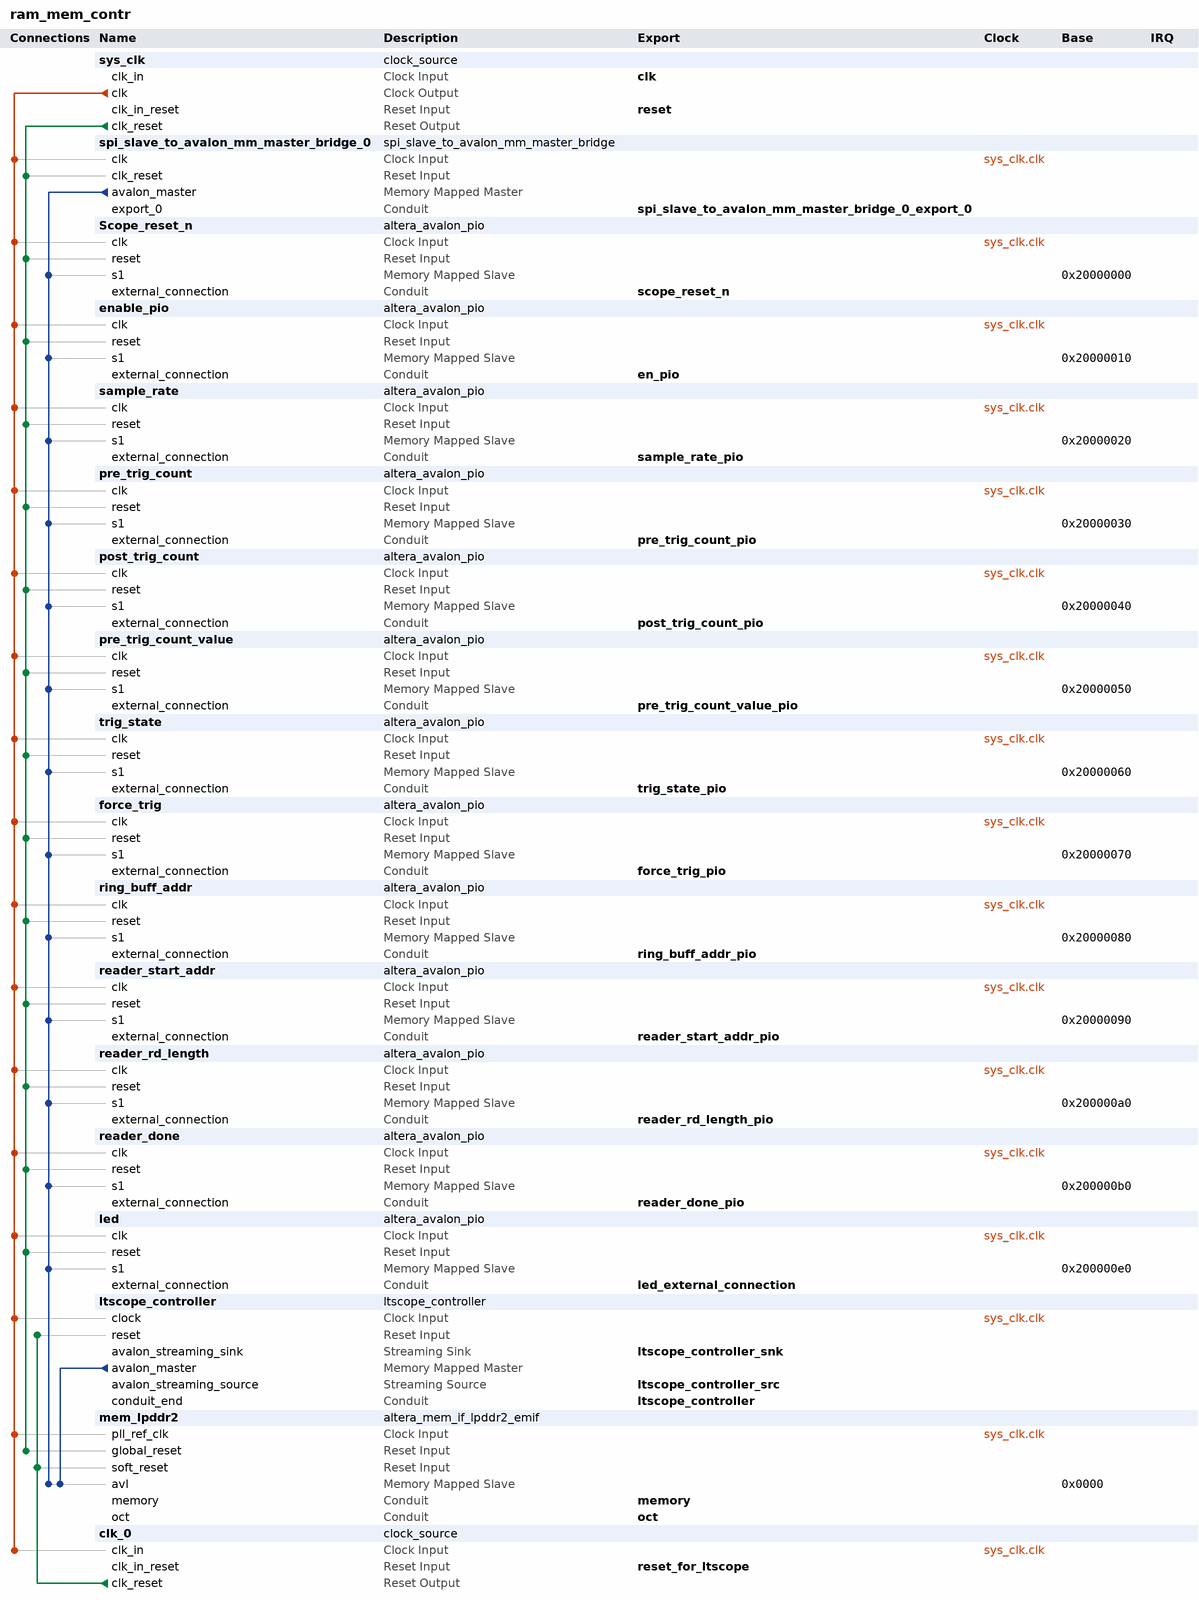
[diagram p0: system contents]
# Platform Designer (Qsys) system ram_mem_contr, Cyclone V 5CGXFC5C6F27C7
# Parameters at their usual value, and those the tool derives, are not listed.
package require -exact qsys 14.1
create_system ram_mem_contr
set_project_property DEVICE_FAMILY {Cyclone V}
set_project_property DEVICE 5CGXFC5C6F27C7

add_instance sys_clk clock_source 14.1
set_instance_parameter_value sys_clk clockFrequency 125000000

add_instance spi_slave_to_avalon_mm_master_bridge_0 spi_slave_to_avalon_mm_master_bridge 14.1
set_instance_parameter_value spi_slave_to_avalon_mm_master_bridge_0 SYNC_DEPTH 2

add_instance Scope_reset_n altera_avalon_pio 14.1
set_instance_parameter_value Scope_reset_n direction Output
set_instance_parameter_value Scope_reset_n width 1

add_instance enable_pio altera_avalon_pio 14.1
set_instance_parameter_value enable_pio direction Output
set_instance_parameter_value enable_pio width 4

add_instance sample_rate altera_avalon_pio 14.1
set_instance_parameter_value sample_rate captureEdge true
set_instance_parameter_value sample_rate direction Output
set_instance_parameter_value sample_rate width 16

add_instance pre_trig_count altera_avalon_pio 14.1
set_instance_parameter_value pre_trig_count direction Output
set_instance_parameter_value pre_trig_count width 32

add_instance post_trig_count altera_avalon_pio 14.1
set_instance_parameter_value post_trig_count direction Output
set_instance_parameter_value post_trig_count width 32

add_instance pre_trig_count_value altera_avalon_pio 14.1
set_instance_parameter_value pre_trig_count_value direction Input
set_instance_parameter_value pre_trig_count_value resetValue 1
set_instance_parameter_value pre_trig_count_value width 32

add_instance trig_state altera_avalon_pio 14.1
set_instance_parameter_value trig_state direction Input
set_instance_parameter_value trig_state width 1

add_instance force_trig altera_avalon_pio 14.1
set_instance_parameter_value force_trig direction Output
set_instance_parameter_value force_trig width 1

add_instance ring_buff_addr altera_avalon_pio 14.1
set_instance_parameter_value ring_buff_addr direction Input
set_instance_parameter_value ring_buff_addr width 32

add_instance reader_start_addr altera_avalon_pio 14.1
set_instance_parameter_value reader_start_addr direction Output
set_instance_parameter_value reader_start_addr width 32

add_instance reader_rd_length altera_avalon_pio 14.1
set_instance_parameter_value reader_rd_length direction Output
set_instance_parameter_value reader_rd_length width 32

add_instance reader_done altera_avalon_pio 14.1
set_instance_parameter_value reader_done direction Input
set_instance_parameter_value reader_done width 1

add_instance led altera_avalon_pio 14.1
set_instance_parameter_value led direction Output
set_instance_parameter_value led width 8

add_instance ltscope_controller ltscope_controller 2.0
set_instance_parameter_value ltscope_controller ADDRESS_DEPTH 29

add_instance mem_lpddr2 altera_mem_if_lpddr2_emif 14.1
set_instance_parameter_value mem_lpddr2 ABSTRACT_REAL_COMPARE_TEST false
set_instance_parameter_value mem_lpddr2 ABS_RAM_MEM_INIT_FILENAME meminit
set_instance_parameter_value mem_lpddr2 ACV_PHY_CLK_ADD_FR_PHASE 0.0
set_instance_parameter_value mem_lpddr2 AC_PACKAGE_DESKEW false
set_instance_parameter_value mem_lpddr2 AC_ROM_USER_ADD_0 0_0000_0000_0000
set_instance_parameter_value mem_lpddr2 AC_ROM_USER_ADD_1 0_0000_0000_1000
set_instance_parameter_value mem_lpddr2 ADDR_ORDER 0
set_instance_parameter_value mem_lpddr2 ADD_EFFICIENCY_MONITOR false
set_instance_parameter_value mem_lpddr2 ADD_EXTERNAL_SEQ_DEBUG_NIOS false
set_instance_parameter_value mem_lpddr2 ADVANCED_CK_PHASES false
set_instance_parameter_value mem_lpddr2 ADVERTIZE_SEQUENCER_SW_BUILD_FILES false
set_instance_parameter_value mem_lpddr2 AFI_DEBUG_INFO_WIDTH 32
set_instance_parameter_value mem_lpddr2 ALTMEMPHY_COMPATIBLE_MODE false
set_instance_parameter_value mem_lpddr2 AP_MODE false
set_instance_parameter_value mem_lpddr2 AP_MODE_EN 0
set_instance_parameter_value mem_lpddr2 AVL_DATA_WIDTH_PORT 32,32,32,32,32,32
set_instance_parameter_value mem_lpddr2 AVL_MAX_SIZE 4
set_instance_parameter_value mem_lpddr2 BYTE_ENABLE true
set_instance_parameter_value mem_lpddr2 C2P_WRITE_CLOCK_ADD_PHASE 0.0
set_instance_parameter_value mem_lpddr2 CALIBRATION_MODE Skip
set_instance_parameter_value mem_lpddr2 CALIB_REG_WIDTH 8
set_instance_parameter_value mem_lpddr2 CFG_DATA_REORDERING_TYPE INTER_BANK
set_instance_parameter_value mem_lpddr2 CFG_REORDER_DATA true
set_instance_parameter_value mem_lpddr2 CFG_TCCD_NS 2.5
set_instance_parameter_value mem_lpddr2 COMMAND_PHASE 0.0
set_instance_parameter_value mem_lpddr2 CONTROLLER_LATENCY 5
set_instance_parameter_value mem_lpddr2 CORE_DEBUG_CONNECTION EXPORT
set_instance_parameter_value mem_lpddr2 CPORT_TYPE_PORT Bidirectional,Bidirectional,Bidirectional,Bidirectional,Bidirectional,Bidirectional
set_instance_parameter_value mem_lpddr2 CTL_AUTOPCH_EN false
set_instance_parameter_value mem_lpddr2 CTL_CMD_QUEUE_DEPTH 8
set_instance_parameter_value mem_lpddr2 CTL_CSR_CONNECTION INTERNAL_JTAG
set_instance_parameter_value mem_lpddr2 CTL_CSR_ENABLED false
set_instance_parameter_value mem_lpddr2 CTL_CSR_READ_ONLY 1
set_instance_parameter_value mem_lpddr2 CTL_DEEP_POWERDN_EN false
set_instance_parameter_value mem_lpddr2 CTL_DYNAMIC_BANK_ALLOCATION false
set_instance_parameter_value mem_lpddr2 CTL_DYNAMIC_BANK_NUM 4
set_instance_parameter_value mem_lpddr2 CTL_ECC_AUTO_CORRECTION_ENABLED false
set_instance_parameter_value mem_lpddr2 CTL_ECC_ENABLED false
set_instance_parameter_value mem_lpddr2 CTL_ENABLE_BURST_INTERRUPT false
set_instance_parameter_value mem_lpddr2 CTL_ENABLE_BURST_TERMINATE false
set_instance_parameter_value mem_lpddr2 CTL_HRB_ENABLED false
set_instance_parameter_value mem_lpddr2 CTL_LOOK_AHEAD_DEPTH 4
set_instance_parameter_value mem_lpddr2 CTL_SELF_REFRESH_EN false
set_instance_parameter_value mem_lpddr2 CTL_USR_REFRESH_EN false
set_instance_parameter_value mem_lpddr2 CTL_ZQCAL_EN false
set_instance_parameter_value mem_lpddr2 CUT_NEW_FAMILY_TIMING true
set_instance_parameter_value mem_lpddr2 DAT_DATA_WIDTH 32
set_instance_parameter_value mem_lpddr2 DEBUG_MODE false
set_instance_parameter_value mem_lpddr2 DEVICE_DEPTH 1
set_instance_parameter_value mem_lpddr2 DISABLE_CHILD_MESSAGING false
set_instance_parameter_value mem_lpddr2 DISCRETE_FLY_BY true
set_instance_parameter_value mem_lpddr2 DLL_SHARING_MODE None
set_instance_parameter_value mem_lpddr2 DQS_DQSN_MODE DIFFERENTIAL
set_instance_parameter_value mem_lpddr2 DQ_INPUT_REG_USE_CLKN false
set_instance_parameter_value mem_lpddr2 DUPLICATE_AC false
set_instance_parameter_value mem_lpddr2 ED_EXPORT_SEQ_DEBUG false
set_instance_parameter_value mem_lpddr2 ENABLE_ABS_RAM_MEM_INIT false
set_instance_parameter_value mem_lpddr2 ENABLE_BONDING false
set_instance_parameter_value mem_lpddr2 ENABLE_BURST_MERGE false
set_instance_parameter_value mem_lpddr2 ENABLE_CTRL_AVALON_INTERFACE true
set_instance_parameter_value mem_lpddr2 ENABLE_DELAY_CHAIN_WRITE false
set_instance_parameter_value mem_lpddr2 ENABLE_EMIT_BFM_MASTER false
set_instance_parameter_value mem_lpddr2 ENABLE_EXPORT_SEQ_DEBUG_BRIDGE false
set_instance_parameter_value mem_lpddr2 ENABLE_EXTRA_REPORTING false
set_instance_parameter_value mem_lpddr2 ENABLE_ISS_PROBES false
set_instance_parameter_value mem_lpddr2 ENABLE_NON_DESTRUCTIVE_CALIB false
set_instance_parameter_value mem_lpddr2 ENABLE_NON_DES_CAL false
set_instance_parameter_value mem_lpddr2 ENABLE_NON_DES_CAL_TEST false
set_instance_parameter_value mem_lpddr2 ENABLE_SEQUENCER_MARGINING_ON_BY_DEFAULT false
set_instance_parameter_value mem_lpddr2 ENABLE_USER_ECC false
set_instance_parameter_value mem_lpddr2 EXPORT_AFI_HALF_CLK false
set_instance_parameter_value mem_lpddr2 FORCED_NON_LDC_ADDR_CMD_MEM_CK_INVERT false
set_instance_parameter_value mem_lpddr2 FORCED_NUM_WRITE_FR_CYCLE_SHIFTS 0
set_instance_parameter_value mem_lpddr2 FORCE_DQS_TRACKING AUTO
set_instance_parameter_value mem_lpddr2 FORCE_MAX_LATENCY_COUNT_WIDTH 0
set_instance_parameter_value mem_lpddr2 FORCE_SEQUENCER_TCL_DEBUG_MODE false
set_instance_parameter_value mem_lpddr2 FORCE_SHADOW_REGS AUTO
set_instance_parameter_value mem_lpddr2 HARD_EMIF false
set_instance_parameter_value mem_lpddr2 HCX_COMPAT_MODE false
set_instance_parameter_value mem_lpddr2 HHP_HPS false
set_instance_parameter_value mem_lpddr2 HHP_HPS_SIMULATION false
set_instance_parameter_value mem_lpddr2 HHP_HPS_VERIFICATION false
set_instance_parameter_value mem_lpddr2 HPS_PROTOCOL DEFAULT
set_instance_parameter_value mem_lpddr2 INCLUDE_BOARD_DELAY_MODEL false
set_instance_parameter_value mem_lpddr2 INCLUDE_MULTIRANK_BOARD_DELAY_MODEL false
set_instance_parameter_value mem_lpddr2 IS_ES_DEVICE false
set_instance_parameter_value mem_lpddr2 LOCAL_ID_WIDTH 8
set_instance_parameter_value mem_lpddr2 MARGIN_VARIATION_TEST false
set_instance_parameter_value mem_lpddr2 MAX_PENDING_RD_CMD 32
set_instance_parameter_value mem_lpddr2 MAX_PENDING_WR_CMD 16
set_instance_parameter_value mem_lpddr2 MEM_ATCL 0
set_instance_parameter_value mem_lpddr2 MEM_AUTO_LEVELING_MODE true
set_instance_parameter_value mem_lpddr2 MEM_BANKADDR_WIDTH 3
set_instance_parameter_value mem_lpddr2 MEM_BL 8
set_instance_parameter_value mem_lpddr2 MEM_BT Sequential
set_instance_parameter_value mem_lpddr2 MEM_CK_PHASE 0.0
set_instance_parameter_value mem_lpddr2 MEM_CK_WIDTH 1
set_instance_parameter_value mem_lpddr2 MEM_CLK_EN_WIDTH 1
set_instance_parameter_value mem_lpddr2 MEM_CLK_FREQ 300.0
set_instance_parameter_value mem_lpddr2 MEM_CLK_FREQ_MAX 400.0
set_instance_parameter_value mem_lpddr2 MEM_COL_ADDR_WIDTH 10
set_instance_parameter_value mem_lpddr2 MEM_CS_WIDTH 1
set_instance_parameter_value mem_lpddr2 MEM_DEVICE MISSING_MODEL
set_instance_parameter_value mem_lpddr2 MEM_DLL_EN true
set_instance_parameter_value mem_lpddr2 MEM_DQ_PER_DQS 8
set_instance_parameter_value mem_lpddr2 MEM_DQ_WIDTH 32
set_instance_parameter_value mem_lpddr2 MEM_DRV_STR 40
set_instance_parameter_value mem_lpddr2 MEM_FORMAT DISCRETE
set_instance_parameter_value mem_lpddr2 MEM_GUARANTEED_WRITE_INIT false
set_instance_parameter_value mem_lpddr2 MEM_IF_BOARD_BASE_DELAY 10
set_instance_parameter_value mem_lpddr2 MEM_IF_DM_PINS_EN true
set_instance_parameter_value mem_lpddr2 MEM_IF_DQSN_EN true
set_instance_parameter_value mem_lpddr2 MEM_IF_SIM_VALID_WINDOW 0
set_instance_parameter_value mem_lpddr2 MEM_INIT_EN false
set_instance_parameter_value mem_lpddr2 MEM_MIRROR_ADDRESSING 0
set_instance_parameter_value mem_lpddr2 MEM_NUMBER_OF_DIMMS 1
set_instance_parameter_value mem_lpddr2 MEM_NUMBER_OF_RANKS_PER_DEVICE 1
set_instance_parameter_value mem_lpddr2 MEM_NUMBER_OF_RANKS_PER_DIMM 1
set_instance_parameter_value mem_lpddr2 MEM_RANK_MULTIPLICATION_FACTOR 1
set_instance_parameter_value mem_lpddr2 MEM_ROW_ADDR_WIDTH 14
set_instance_parameter_value mem_lpddr2 MEM_TCL 7
set_instance_parameter_value mem_lpddr2 MEM_TFAW_NS 50.0
set_instance_parameter_value mem_lpddr2 MEM_TINIT_US 200
set_instance_parameter_value mem_lpddr2 MEM_TMRD_CK 2
set_instance_parameter_value mem_lpddr2 MEM_TRAS_NS 70.0
set_instance_parameter_value mem_lpddr2 MEM_TRCD_NS 18.0
set_instance_parameter_value mem_lpddr2 MEM_TREFI_US 3.9
set_instance_parameter_value mem_lpddr2 MEM_TRFC_NS 60.0
set_instance_parameter_value mem_lpddr2 MEM_TRP_NS 18.0
set_instance_parameter_value mem_lpddr2 MEM_TRRD_NS 10.0
set_instance_parameter_value mem_lpddr2 MEM_TRTP_NS 7.5
set_instance_parameter_value mem_lpddr2 MEM_TWR_NS 15.0
set_instance_parameter_value mem_lpddr2 MEM_TWTR 2
set_instance_parameter_value mem_lpddr2 MEM_USER_LEVELING_MODE Leveling
set_instance_parameter_value mem_lpddr2 MEM_VENDOR JEDEC
set_instance_parameter_value mem_lpddr2 MEM_VERBOSE true
set_instance_parameter_value mem_lpddr2 MRS_MIRROR_PING_PONG_ATSO false
set_instance_parameter_value mem_lpddr2 MULTICAST_EN false
set_instance_parameter_value mem_lpddr2 NEXTGEN true
set_instance_parameter_value mem_lpddr2 NIOS_ROM_DATA_WIDTH 32
set_instance_parameter_value mem_lpddr2 NUM_DLL_SHARING_INTERFACES 1
set_instance_parameter_value mem_lpddr2 NUM_EXTRA_REPORT_PATH 10
set_instance_parameter_value mem_lpddr2 NUM_OCT_SHARING_INTERFACES 1
set_instance_parameter_value mem_lpddr2 NUM_OF_PORTS 1
set_instance_parameter_value mem_lpddr2 NUM_PLL_SHARING_INTERFACES 1
set_instance_parameter_value mem_lpddr2 OCT_SHARING_MODE None
set_instance_parameter_value mem_lpddr2 P2C_READ_CLOCK_ADD_PHASE 0.0
set_instance_parameter_value mem_lpddr2 PACKAGE_DESKEW false
set_instance_parameter_value mem_lpddr2 PARSE_FRIENDLY_DEVICE_FAMILY_PARAM_VALID false
set_instance_parameter_value mem_lpddr2 PHY_CSR_CONNECTION INTERNAL_JTAG
set_instance_parameter_value mem_lpddr2 PHY_CSR_ENABLED false
set_instance_parameter_value mem_lpddr2 PHY_ONLY false
set_instance_parameter_value mem_lpddr2 PINGPONGPHY_EN false
set_instance_parameter_value mem_lpddr2 PLL_ADDR_CMD_CLK_DIV_PARAM 0
set_instance_parameter_value mem_lpddr2 PLL_ADDR_CMD_CLK_FREQ_PARAM 0.0
set_instance_parameter_value mem_lpddr2 PLL_ADDR_CMD_CLK_MULT_PARAM 0
set_instance_parameter_value mem_lpddr2 PLL_ADDR_CMD_CLK_PHASE_PS_PARAM 0
set_instance_parameter_value mem_lpddr2 PLL_AFI_CLK_DIV_PARAM 0
set_instance_parameter_value mem_lpddr2 PLL_AFI_CLK_FREQ_PARAM 0.0
set_instance_parameter_value mem_lpddr2 PLL_AFI_CLK_MULT_PARAM 0
set_instance_parameter_value mem_lpddr2 PLL_AFI_CLK_PHASE_PS_PARAM 0
set_instance_parameter_value mem_lpddr2 PLL_AFI_HALF_CLK_DIV_PARAM 0
set_instance_parameter_value mem_lpddr2 PLL_AFI_HALF_CLK_FREQ_PARAM 0.0
set_instance_parameter_value mem_lpddr2 PLL_AFI_HALF_CLK_MULT_PARAM 0
set_instance_parameter_value mem_lpddr2 PLL_AFI_HALF_CLK_PHASE_PS_PARAM 0
set_instance_parameter_value mem_lpddr2 PLL_AFI_PHY_CLK_DIV_PARAM 0
set_instance_parameter_value mem_lpddr2 PLL_AFI_PHY_CLK_FREQ_PARAM 0.0
set_instance_parameter_value mem_lpddr2 PLL_AFI_PHY_CLK_MULT_PARAM 0
set_instance_parameter_value mem_lpddr2 PLL_AFI_PHY_CLK_PHASE_PS_PARAM 0
set_instance_parameter_value mem_lpddr2 PLL_C2P_WRITE_CLK_DIV_PARAM 0
set_instance_parameter_value mem_lpddr2 PLL_C2P_WRITE_CLK_FREQ_PARAM 0.0
set_instance_parameter_value mem_lpddr2 PLL_C2P_WRITE_CLK_MULT_PARAM 0
set_instance_parameter_value mem_lpddr2 PLL_C2P_WRITE_CLK_PHASE_PS_PARAM 0
set_instance_parameter_value mem_lpddr2 PLL_CLK_PARAM_VALID false
set_instance_parameter_value mem_lpddr2 PLL_CONFIG_CLK_DIV_PARAM 0
set_instance_parameter_value mem_lpddr2 PLL_CONFIG_CLK_FREQ_PARAM 0.0
set_instance_parameter_value mem_lpddr2 PLL_CONFIG_CLK_MULT_PARAM 0
set_instance_parameter_value mem_lpddr2 PLL_CONFIG_CLK_PHASE_PS_PARAM 0
set_instance_parameter_value mem_lpddr2 PLL_DR_CLK_DIV_PARAM 0
set_instance_parameter_value mem_lpddr2 PLL_DR_CLK_FREQ_PARAM 0.0
set_instance_parameter_value mem_lpddr2 PLL_DR_CLK_MULT_PARAM 0
set_instance_parameter_value mem_lpddr2 PLL_DR_CLK_PHASE_PS_PARAM 0
set_instance_parameter_value mem_lpddr2 PLL_HR_CLK_DIV_PARAM 0
set_instance_parameter_value mem_lpddr2 PLL_HR_CLK_FREQ_PARAM 0.0
set_instance_parameter_value mem_lpddr2 PLL_HR_CLK_MULT_PARAM 0
set_instance_parameter_value mem_lpddr2 PLL_HR_CLK_PHASE_PS_PARAM 0
set_instance_parameter_value mem_lpddr2 PLL_LOCATION Top_Bottom
set_instance_parameter_value mem_lpddr2 PLL_MEM_CLK_DIV_PARAM 0
set_instance_parameter_value mem_lpddr2 PLL_MEM_CLK_FREQ_PARAM 0.0
set_instance_parameter_value mem_lpddr2 PLL_MEM_CLK_MULT_PARAM 0
set_instance_parameter_value mem_lpddr2 PLL_MEM_CLK_PHASE_PS_PARAM 0
set_instance_parameter_value mem_lpddr2 PLL_NIOS_CLK_DIV_PARAM 0
set_instance_parameter_value mem_lpddr2 PLL_NIOS_CLK_FREQ_PARAM 0.0
set_instance_parameter_value mem_lpddr2 PLL_NIOS_CLK_MULT_PARAM 0
set_instance_parameter_value mem_lpddr2 PLL_NIOS_CLK_PHASE_PS_PARAM 0
set_instance_parameter_value mem_lpddr2 PLL_P2C_READ_CLK_DIV_PARAM 0
set_instance_parameter_value mem_lpddr2 PLL_P2C_READ_CLK_FREQ_PARAM 0.0
set_instance_parameter_value mem_lpddr2 PLL_P2C_READ_CLK_MULT_PARAM 0
set_instance_parameter_value mem_lpddr2 PLL_P2C_READ_CLK_PHASE_PS_PARAM 0
set_instance_parameter_value mem_lpddr2 PLL_SHARING_MODE None
set_instance_parameter_value mem_lpddr2 PLL_WRITE_CLK_DIV_PARAM 0
set_instance_parameter_value mem_lpddr2 PLL_WRITE_CLK_FREQ_PARAM 0.0
set_instance_parameter_value mem_lpddr2 PLL_WRITE_CLK_MULT_PARAM 0
set_instance_parameter_value mem_lpddr2 PLL_WRITE_CLK_PHASE_PS_PARAM 0
set_instance_parameter_value mem_lpddr2 POWER_OF_TWO_BUS false
set_instance_parameter_value mem_lpddr2 PRIORITY_PORT 1,1,1,1,1,1
set_instance_parameter_value mem_lpddr2 RATE Half
set_instance_parameter_value mem_lpddr2 READ_DQ_DQS_CLOCK_SOURCE INVERTED_DQS_BUS
set_instance_parameter_value mem_lpddr2 READ_FIFO_SIZE 8
set_instance_parameter_value mem_lpddr2 REFRESH_BURST_VALIDATION false
set_instance_parameter_value mem_lpddr2 REFRESH_INTERVAL 15000
set_instance_parameter_value mem_lpddr2 REF_CLK_FREQ 125.0
set_instance_parameter_value mem_lpddr2 REF_CLK_FREQ_MAX_PARAM 0.0
set_instance_parameter_value mem_lpddr2 REF_CLK_FREQ_MIN_PARAM 0.0
set_instance_parameter_value mem_lpddr2 REF_CLK_FREQ_PARAM_VALID false
set_instance_parameter_value mem_lpddr2 SEQUENCER_TYPE NIOS
set_instance_parameter_value mem_lpddr2 SEQ_MODE 0
set_instance_parameter_value mem_lpddr2 SKIP_MEM_INIT true
set_instance_parameter_value mem_lpddr2 SOPC_COMPAT_RESET false
set_instance_parameter_value mem_lpddr2 SPEED_GRADE 7
set_instance_parameter_value mem_lpddr2 STARVE_LIMIT 10
set_instance_parameter_value mem_lpddr2 TIMING_BOARD_AC_EYE_REDUCTION_H 0.0
set_instance_parameter_value mem_lpddr2 TIMING_BOARD_AC_EYE_REDUCTION_SU 0.0
set_instance_parameter_value mem_lpddr2 TIMING_BOARD_AC_SKEW 0.02
set_instance_parameter_value mem_lpddr2 TIMING_BOARD_AC_SLEW_RATE 1.0
set_instance_parameter_value mem_lpddr2 TIMING_BOARD_AC_TO_CK_SKEW 0.0
set_instance_parameter_value mem_lpddr2 TIMING_BOARD_CK_CKN_SLEW_RATE 2.0
set_instance_parameter_value mem_lpddr2 TIMING_BOARD_DELTA_DQS_ARRIVAL_TIME 0.0
set_instance_parameter_value mem_lpddr2 TIMING_BOARD_DELTA_READ_DQS_ARRIVAL_TIME 0.0
set_instance_parameter_value mem_lpddr2 TIMING_BOARD_DERATE_METHOD AUTO
set_instance_parameter_value mem_lpddr2 TIMING_BOARD_DQS_DQSN_SLEW_RATE 2.0
set_instance_parameter_value mem_lpddr2 TIMING_BOARD_DQ_EYE_REDUCTION 0.0
set_instance_parameter_value mem_lpddr2 TIMING_BOARD_DQ_SLEW_RATE 1.0
set_instance_parameter_value mem_lpddr2 TIMING_BOARD_DQ_TO_DQS_SKEW 0.0
set_instance_parameter_value mem_lpddr2 TIMING_BOARD_ISI_METHOD AUTO
set_instance_parameter_value mem_lpddr2 TIMING_BOARD_MAX_CK_DELAY 0.33
set_instance_parameter_value mem_lpddr2 TIMING_BOARD_MAX_DQS_DELAY 0.34
set_instance_parameter_value mem_lpddr2 TIMING_BOARD_READ_DQ_EYE_REDUCTION 0.0
set_instance_parameter_value mem_lpddr2 TIMING_BOARD_SKEW_BETWEEN_DIMMS 0.05
set_instance_parameter_value mem_lpddr2 TIMING_BOARD_SKEW_BETWEEN_DQS 0.02
set_instance_parameter_value mem_lpddr2 TIMING_BOARD_SKEW_CKDQS_DIMM_MAX 0.01
set_instance_parameter_value mem_lpddr2 TIMING_BOARD_SKEW_CKDQS_DIMM_MIN -0.01
set_instance_parameter_value mem_lpddr2 TIMING_BOARD_SKEW_WITHIN_DQS 0.02
set_instance_parameter_value mem_lpddr2 TIMING_BOARD_TDH 0.0
set_instance_parameter_value mem_lpddr2 TIMING_BOARD_TDS 0.0
set_instance_parameter_value mem_lpddr2 TIMING_BOARD_TIH 0.0
set_instance_parameter_value mem_lpddr2 TIMING_BOARD_TIS 0.0
set_instance_parameter_value mem_lpddr2 TIMING_TDH 270
set_instance_parameter_value mem_lpddr2 TIMING_TDQSCK 5500
set_instance_parameter_value mem_lpddr2 TIMING_TDQSCKDL 1200
set_instance_parameter_value mem_lpddr2 TIMING_TDQSCKDM 900
set_instance_parameter_value mem_lpddr2 TIMING_TDQSCKDS 450
set_instance_parameter_value mem_lpddr2 TIMING_TDQSH 0.4
set_instance_parameter_value mem_lpddr2 TIMING_TDQSQ 240
set_instance_parameter_value mem_lpddr2 TIMING_TDQSS 1.0
set_instance_parameter_value mem_lpddr2 TIMING_TDS 270
set_instance_parameter_value mem_lpddr2 TIMING_TDSH 0.2
set_instance_parameter_value mem_lpddr2 TIMING_TDSS 0.2
set_instance_parameter_value mem_lpddr2 TIMING_TIH 290
set_instance_parameter_value mem_lpddr2 TIMING_TIS 290
set_instance_parameter_value mem_lpddr2 TIMING_TQHS 280
set_instance_parameter_value mem_lpddr2 TRACKING_ERROR_TEST false
set_instance_parameter_value mem_lpddr2 TRACKING_WATCH_TEST false
set_instance_parameter_value mem_lpddr2 TREFI 35100
set_instance_parameter_value mem_lpddr2 TRFC 350
set_instance_parameter_value mem_lpddr2 USER_DEBUG_LEVEL 1
set_instance_parameter_value mem_lpddr2 USE_AXI_ADAPTOR false
set_instance_parameter_value mem_lpddr2 USE_FAKE_PHY false
set_instance_parameter_value mem_lpddr2 USE_MEM_CLK_FREQ false
set_instance_parameter_value mem_lpddr2 USE_MM_ADAPTOR true
set_instance_parameter_value mem_lpddr2 USE_SEQUENCER_BFM false
set_instance_parameter_value mem_lpddr2 WEIGHT_PORT 0,0,0,0,0,0
set_instance_parameter_value mem_lpddr2 WRBUFFER_ADDR_WIDTH 6

add_instance clk_0 clock_source 14.1
set_instance_parameter_value clk_0 clockFrequency 125000000

# connections
add_connection sys_clk.clk clk_0.clk_in clock
add_connection sys_clk.clk enable_pio.clk clock
add_connection sys_clk.clk force_trig.clk clock
add_connection sys_clk.clk led.clk clock
add_connection sys_clk.clk ltscope_controller.clock clock
add_connection sys_clk.clk mem_lpddr2.pll_ref_clk clock
add_connection sys_clk.clk post_trig_count.clk clock
add_connection sys_clk.clk pre_trig_count.clk clock
add_connection sys_clk.clk pre_trig_count_value.clk clock
add_connection sys_clk.clk reader_done.clk clock
add_connection sys_clk.clk reader_rd_length.clk clock
add_connection sys_clk.clk reader_start_addr.clk clock
add_connection sys_clk.clk ring_buff_addr.clk clock
add_connection sys_clk.clk sample_rate.clk clock
add_connection sys_clk.clk Scope_reset_n.clk clock
add_connection sys_clk.clk spi_slave_to_avalon_mm_master_bridge_0.clk clock
add_connection sys_clk.clk trig_state.clk clock
add_connection clk_0.clk_reset ltscope_controller.reset reset
add_connection clk_0.clk_reset mem_lpddr2.soft_reset reset
add_connection sys_clk.clk_reset enable_pio.reset reset
add_connection sys_clk.clk_reset force_trig.reset reset
add_connection sys_clk.clk_reset led.reset reset
add_connection sys_clk.clk_reset mem_lpddr2.global_reset reset
add_connection sys_clk.clk_reset post_trig_count.reset reset
add_connection sys_clk.clk_reset pre_trig_count.reset reset
add_connection sys_clk.clk_reset pre_trig_count_value.reset reset
add_connection sys_clk.clk_reset reader_done.reset reset
add_connection sys_clk.clk_reset reader_rd_length.reset reset
add_connection sys_clk.clk_reset reader_start_addr.reset reset
add_connection sys_clk.clk_reset ring_buff_addr.reset reset
add_connection sys_clk.clk_reset sample_rate.reset reset
add_connection sys_clk.clk_reset Scope_reset_n.reset reset
add_connection sys_clk.clk_reset spi_slave_to_avalon_mm_master_bridge_0.clk_reset reset
add_connection sys_clk.clk_reset trig_state.reset reset
add_connection ltscope_controller.avalon_master mem_lpddr2.avl avalon
set_connection_parameter_value ltscope_controller.avalon_master/mem_lpddr2.avl baseAddress 0x0000
add_connection spi_slave_to_avalon_mm_master_bridge_0.avalon_master enable_pio.s1 avalon
set_connection_parameter_value spi_slave_to_avalon_mm_master_bridge_0.avalon_master/enable_pio.s1 baseAddress 0x20000010
add_connection spi_slave_to_avalon_mm_master_bridge_0.avalon_master force_trig.s1 avalon
set_connection_parameter_value spi_slave_to_avalon_mm_master_bridge_0.avalon_master/force_trig.s1 baseAddress 0x20000070
add_connection spi_slave_to_avalon_mm_master_bridge_0.avalon_master led.s1 avalon
set_connection_parameter_value spi_slave_to_avalon_mm_master_bridge_0.avalon_master/led.s1 baseAddress 0x200000e0
add_connection spi_slave_to_avalon_mm_master_bridge_0.avalon_master mem_lpddr2.avl avalon
set_connection_parameter_value spi_slave_to_avalon_mm_master_bridge_0.avalon_master/mem_lpddr2.avl baseAddress 0x0000
add_connection spi_slave_to_avalon_mm_master_bridge_0.avalon_master post_trig_count.s1 avalon
set_connection_parameter_value spi_slave_to_avalon_mm_master_bridge_0.avalon_master/post_trig_count.s1 baseAddress 0x20000040
add_connection spi_slave_to_avalon_mm_master_bridge_0.avalon_master pre_trig_count.s1 avalon
set_connection_parameter_value spi_slave_to_avalon_mm_master_bridge_0.avalon_master/pre_trig_count.s1 baseAddress 0x20000030
add_connection spi_slave_to_avalon_mm_master_bridge_0.avalon_master pre_trig_count_value.s1 avalon
set_connection_parameter_value spi_slave_to_avalon_mm_master_bridge_0.avalon_master/pre_trig_count_value.s1 baseAddress 0x20000050
add_connection spi_slave_to_avalon_mm_master_bridge_0.avalon_master reader_done.s1 avalon
set_connection_parameter_value spi_slave_to_avalon_mm_master_bridge_0.avalon_master/reader_done.s1 baseAddress 0x200000b0
add_connection spi_slave_to_avalon_mm_master_bridge_0.avalon_master reader_rd_length.s1 avalon
set_connection_parameter_value spi_slave_to_avalon_mm_master_bridge_0.avalon_master/reader_rd_length.s1 baseAddress 0x200000a0
add_connection spi_slave_to_avalon_mm_master_bridge_0.avalon_master reader_start_addr.s1 avalon
set_connection_parameter_value spi_slave_to_avalon_mm_master_bridge_0.avalon_master/reader_start_addr.s1 baseAddress 0x20000090
add_connection spi_slave_to_avalon_mm_master_bridge_0.avalon_master ring_buff_addr.s1 avalon
set_connection_parameter_value spi_slave_to_avalon_mm_master_bridge_0.avalon_master/ring_buff_addr.s1 baseAddress 0x20000080
add_connection spi_slave_to_avalon_mm_master_bridge_0.avalon_master sample_rate.s1 avalon
set_connection_parameter_value spi_slave_to_avalon_mm_master_bridge_0.avalon_master/sample_rate.s1 baseAddress 0x20000020
add_connection spi_slave_to_avalon_mm_master_bridge_0.avalon_master Scope_reset_n.s1 avalon
set_connection_parameter_value spi_slave_to_avalon_mm_master_bridge_0.avalon_master/Scope_reset_n.s1 baseAddress 0x20000000
add_connection spi_slave_to_avalon_mm_master_bridge_0.avalon_master trig_state.s1 avalon
set_connection_parameter_value spi_slave_to_avalon_mm_master_bridge_0.avalon_master/trig_state.s1 baseAddress 0x20000060

# exported interfaces
add_interface clk clock sink
set_interface_property clk EXPORT_OF sys_clk.clk_in
add_interface en_pio conduit end
set_interface_property en_pio EXPORT_OF enable_pio.external_connection
add_interface force_trig_pio conduit end
set_interface_property force_trig_pio EXPORT_OF force_trig.external_connection
add_interface led_external_connection conduit end
set_interface_property led_external_connection EXPORT_OF led.external_connection
add_interface ltscope_controller conduit end
set_interface_property ltscope_controller EXPORT_OF ltscope_controller.conduit_end
add_interface ltscope_controller_snk avalon_streaming sink
set_interface_property ltscope_controller_snk EXPORT_OF ltscope_controller.avalon_streaming_sink
add_interface ltscope_controller_src avalon_streaming source
set_interface_property ltscope_controller_src EXPORT_OF ltscope_controller.avalon_streaming_source
add_interface memory conduit end
set_interface_property memory EXPORT_OF mem_lpddr2.memory
add_interface oct conduit end
set_interface_property oct EXPORT_OF mem_lpddr2.oct
add_interface post_trig_count_pio conduit end
set_interface_property post_trig_count_pio EXPORT_OF post_trig_count.external_connection
add_interface pre_trig_count_pio conduit end
set_interface_property pre_trig_count_pio EXPORT_OF pre_trig_count.external_connection
add_interface pre_trig_count_value_pio conduit end
set_interface_property pre_trig_count_value_pio EXPORT_OF pre_trig_count_value.external_connection
add_interface reader_done_pio conduit end
set_interface_property reader_done_pio EXPORT_OF reader_done.external_connection
add_interface reader_rd_length_pio conduit end
set_interface_property reader_rd_length_pio EXPORT_OF reader_rd_length.external_connection
add_interface reader_start_addr_pio conduit end
set_interface_property reader_start_addr_pio EXPORT_OF reader_start_addr.external_connection
add_interface reset reset sink
set_interface_property reset EXPORT_OF sys_clk.clk_in_reset
add_interface reset_for_ltscope reset sink
set_interface_property reset_for_ltscope EXPORT_OF clk_0.clk_in_reset
add_interface ring_buff_addr_pio conduit end
set_interface_property ring_buff_addr_pio EXPORT_OF ring_buff_addr.external_connection
add_interface sample_rate_pio conduit end
set_interface_property sample_rate_pio EXPORT_OF sample_rate.external_connection
add_interface scope_reset_n conduit end
set_interface_property scope_reset_n EXPORT_OF Scope_reset_n.external_connection
add_interface spi_slave_to_avalon_mm_master_bridge_0_export_0 conduit end
set_interface_property spi_slave_to_avalon_mm_master_bridge_0_export_0 EXPORT_OF spi_slave_to_avalon_mm_master_bridge_0.export_0
add_interface trig_state_pio conduit end
set_interface_property trig_state_pio EXPORT_OF trig_state.external_connection

set_interconnect_requirement {$system} qsys_mm.clockCrossingAdapter HANDSHAKE
set_interconnect_requirement {$system} qsys_mm.insertDefaultSlave false
set_interconnect_requirement {$system} qsys_mm.maxAdditionalLatency 1

save_system ram_mem_contr.qsys
